# Altium schematic sheet Neopixel.SchDoc: Neopixel
size A4
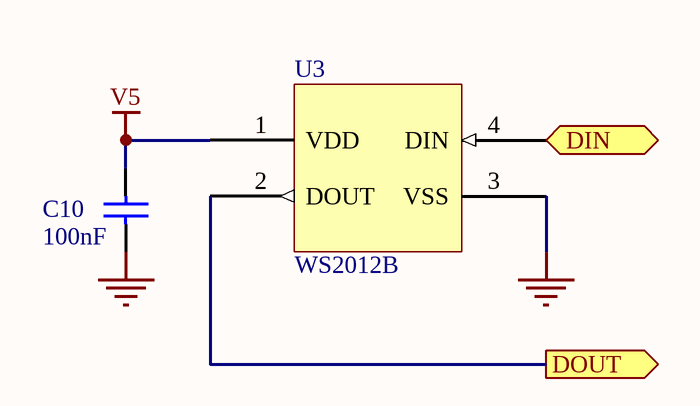
[diagram p0: Neopixel.SchDoc]

## Parts
C10  100nF  [CAP0603]
U3  WS2012B  [WS2812b]

## Ports
DIN (in), DOUT (out)

## Nets
GND: C10.1 U3.3(VSS)
V5: C10.2 U3.1(VDD)
DIN: U3.4(DIN) ; port DIN
DOUT: U3.2(DOUT) ; port DOUT

## Notes on the sheet
- Title
- Size:
- Date:
- A4
- Number:
- Time:
- Revision:
- Sheet
- of
- File:

## Library data of the parts
C10 = Cap: Capacitor; Fabricant: TDK; Fournisseur: Farnell; RefFabricant: C1608X7R1H104K080AA; RefFournisseur: 1907318; Value: 100nF
U3 = WS2012B: Neopixel; Fabricant: WorldSemi; RefFabricant: WS2812b